# Altium schematic sheet MyCTRL_V2_Base_1.SchDoc
size A4; SheetNumber: 1; SheetTotal: 6
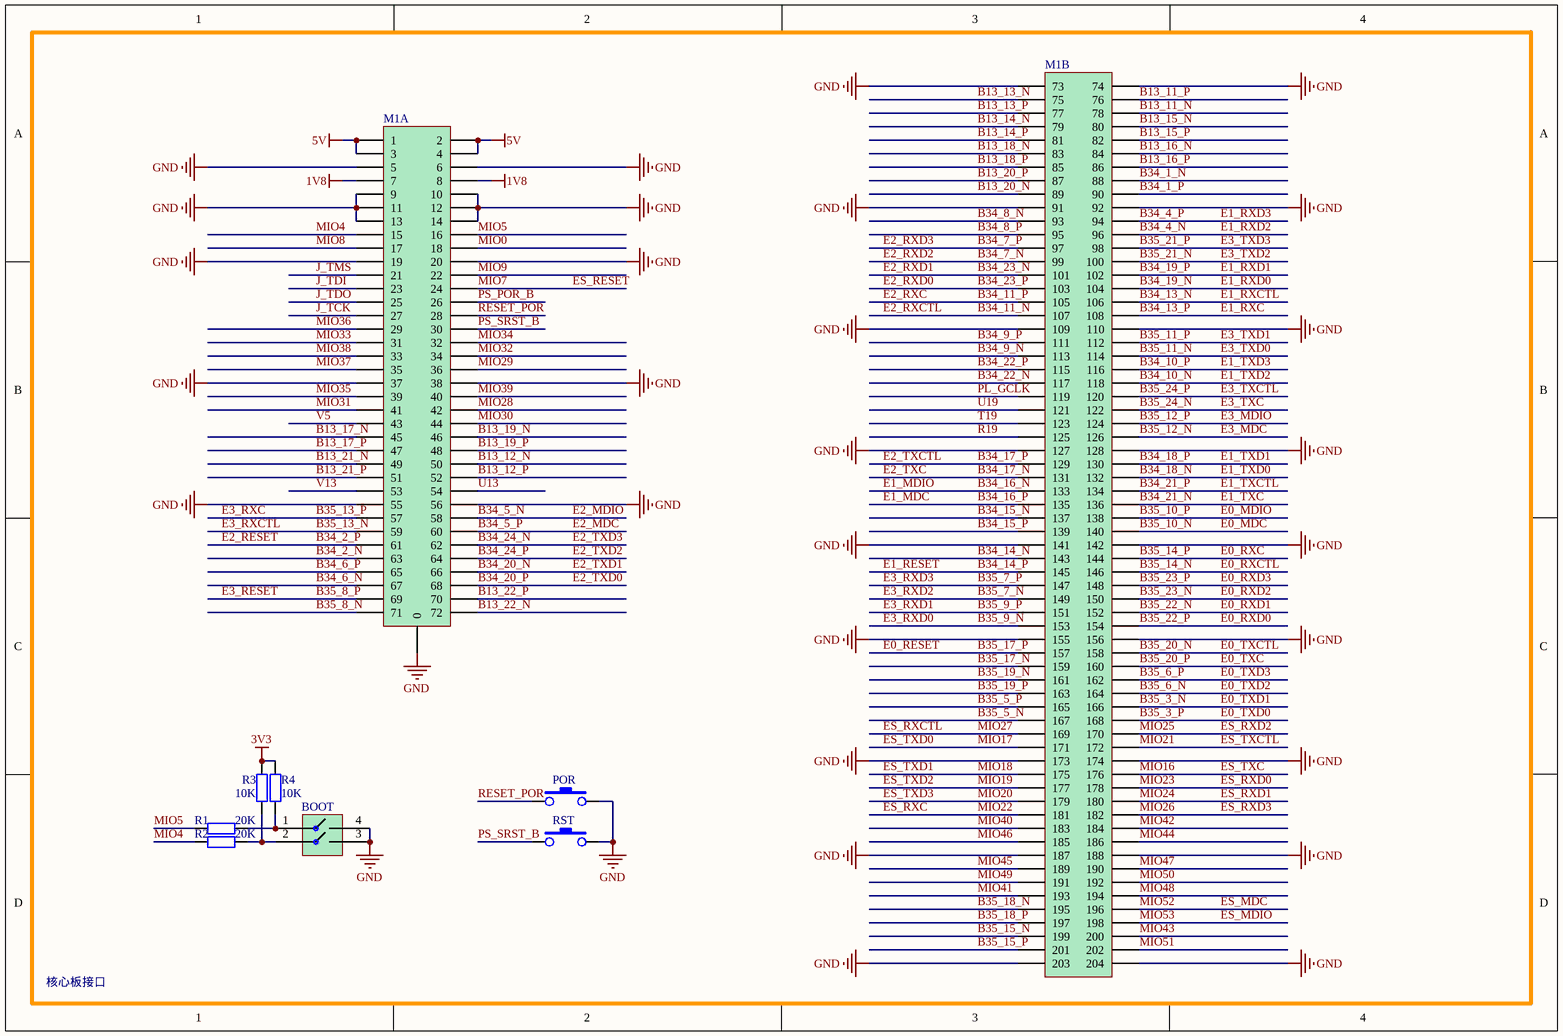
[diagram p0: MyCTRL_V2_Base_1.SchDoc]

## Parts
BOOT  DIP_SWITCH_2.54_2_SMD_S  [DIP_SWITCH_2.54_2_SMD_S]  (value not drawn)
M1  DDR3_204P_H8  [DDR3_204P_H8]  (value not drawn)  (parts A,B of 2)
POR  KEY  [KEY_DIP_6_L]  (value not drawn)
R1  20K  [R_0402]
R2  20K  [R_0402]
R3  10K  [R_0402]
R4  10K  [R_0402]
RST  KEY  [KEY_DIP_6_L]  (value not drawn)

## Nets
1V8: M1.7 M1.8
3V3: R3.2 R4.2
5V: M1.1 M1.2 M1.3 M1.4
GND: BOOT.3 BOOT.4 M1.0 M1.5 M1.6 M1.9 M1.10 M1.11 M1.12 M1.13 M1.14 M1.19 M1.20 M1.37 M1.38 M1.55 M1.56 M1.73 M1.74 M1.91 M1.92 M1.109 M1.110 M1.127 M1.128 M1.141 M1.142 M1.155 M1.156 M1.173 M1.174 M1.187 M1.188 M1.203 M1.204 POR.1 RST.1
B13_11_N: M1.78
B13_11_P: M1.76
B13_12_N: M1.50
B13_12_P: M1.52
B13_13_N: M1.75
B13_13_P: M1.77
B13_14_N: M1.79
B13_14_P: M1.81
B13_15_N: M1.80
B13_15_P: M1.82
B13_16_N: M1.84
B13_16_P: M1.86
B13_17_N: M1.45
B13_17_P: M1.47
B13_18_N: M1.83
B13_18_P: M1.85
B13_19_N: M1.46
B13_19_P: M1.48
B13_20_N: M1.89
B13_20_P: M1.87
B13_21_N: M1.49
B13_21_P: M1.51
B13_22_N: M1.72
B13_22_P: M1.70
B34_1_N: M1.88
B34_1_P: M1.90
B34_2_N: M1.63
B34_2_P: M1.61  [also labelled E2_RESET]
B34_4_N: M1.96  [also labelled E1_RXD2]
B34_4_P: M1.94  [also labelled E1_RXD3]
B34_5_N: M1.58  [also labelled E2_MDIO]
B34_5_P: M1.60  [also labelled E2_MDC]
B34_6_N: M1.67
B34_6_P: M1.65
B34_7_N: M1.99  [also labelled E2_RXD2]
B34_7_P: M1.97  [also labelled E2_RXD3]
B34_8_N: M1.93
B34_8_P: M1.95
B34_9_N: M1.113
B34_9_P: M1.111
B34_10_N: M1.118  [also labelled E1_TXD2]
B34_10_P: M1.116  [also labelled E1_TXD3]
B34_11_N: M1.107  [also labelled E2_RXCTL]
B34_11_P: M1.105  [also labelled E2_RXC]
B34_13_N: M1.106  [also labelled E1_RXCTL]
B34_13_P: M1.108  [also labelled E1_RXC]
B34_14_N: M1.143
B34_14_P: M1.145  [also labelled E1_RESET]
B34_15_N: M1.137
B34_15_P: M1.139
B34_16_N: M1.133  [also labelled E1_MDIO]
B34_16_P: M1.135  [also labelled E1_MDC]
B34_17_N: M1.131  [also labelled E2_TXC]
B34_17_P: M1.129  [also labelled E2_TXCTL]
B34_18_N: M1.132  [also labelled E1_TXD0]
B34_18_P: M1.130  [also labelled E1_TXD1]
B34_19_N: M1.104  [also labelled E1_RXD0]
B34_19_P: M1.102  [also labelled E1_RXD1]
B34_20_N: M1.66  [also labelled E2_TXD1]
B34_20_P: M1.68  [also labelled E2_TXD0]
B34_21_N: M1.136  [also labelled E1_TXC]
B34_21_P: M1.134  [also labelled E1_TXCTL]
B34_22_N: M1.117
B34_22_P: M1.115
B34_23_N: M1.101  [also labelled E2_RXD1]
B34_23_P: M1.103  [also labelled E2_RXD0]
B34_24_N: M1.62  [also labelled E2_TXD3]
B34_24_P: M1.64  [also labelled E2_TXD2]
B35_3_N: M1.166  [also labelled E0_TXD1]
B35_3_P: M1.168  [also labelled E0_TXD0]
B35_5_N: M1.167
B35_5_P: M1.165
B35_6_N: M1.164  [also labelled E0_TXD2]
B35_6_P: M1.162  [also labelled E0_TXD3]
B35_7_N: M1.149  [also labelled E3_RXD2]
B35_7_P: M1.147  [also labelled E3_RXD3]
B35_8_N: M1.71
B35_8_P: M1.69  [also labelled E3_RESET]
B35_9_N: M1.153  [also labelled E3_RXD0]
B35_9_P: M1.151  [also labelled E3_RXD1]
B35_10_N: M1.140  [also labelled E0_MDC]
B35_10_P: M1.138  [also labelled E0_MDIO]
B35_11_N: M1.114  [also labelled E3_TXD0]
B35_11_P: M1.112  [also labelled E3_TXD1]
B35_12_N: M1.126  [also labelled E3_MDC]
B35_12_P: M1.124  [also labelled E3_MDIO]
B35_13_N: M1.59  [also labelled E3_RXCTL]
B35_13_P: M1.57  [also labelled E3_RXC]
B35_14_N: M1.146  [also labelled E0_RXCTL]
B35_14_P: M1.144  [also labelled E0_RXC]
B35_15_N: M1.199
B35_15_P: M1.201
B35_17_N: M1.159
B35_17_P: M1.157  [also labelled E0_RESET]
B35_18_N: M1.195
B35_18_P: M1.197
B35_19_N: M1.161
B35_19_P: M1.163
B35_20_N: M1.158  [also labelled E0_TXCTL]
B35_20_P: M1.160  [also labelled E0_TXC]
B35_21_N: M1.100  [also labelled E3_TXD2]
B35_21_P: M1.98  [also labelled E3_TXD3]
B35_22_N: M1.152  [also labelled E0_RXD1]
B35_22_P: M1.154  [also labelled E0_RXD0]
B35_23_N: M1.150  [also labelled E0_RXD2]
B35_23_P: M1.148  [also labelled E0_RXD3]
B35_24_N: M1.122  [also labelled E3_TXC]
B35_24_P: M1.120  [also labelled E3_TXCTL]
ES_MDC: M1.196  [also labelled MIO52]
ES_MDIO: M1.198  [also labelled MIO53]
ES_RESET: M1.24  [also labelled MIO7]
ES_RXC: M1.181  [also labelled MIO22]
ES_RXCTL: M1.169  [also labelled MIO27]
ES_RXD0: M1.178  [also labelled MIO23]
ES_RXD1: M1.180  [also labelled MIO24]
ES_RXD2: M1.170  [also labelled MIO25]
ES_RXD3: M1.182  [also labelled MIO26]
ES_TXC: M1.176  [also labelled MIO16]
ES_TXCTL: M1.172  [also labelled MIO21]
ES_TXD0: M1.171  [also labelled MIO17]
ES_TXD1: M1.175  [also labelled MIO18]
ES_TXD2: M1.177  [also labelled MIO19]
ES_TXD3: M1.179  [also labelled MIO20]
J_TCK: M1.27
J_TDI: M1.23
J_TDO: M1.25
J_TMS: M1.21
MIO0: M1.18
MIO4: M1.15 R2.2
MIO5: M1.16 R1.2
MIO8: M1.17
MIO9: M1.22
MIO28: M1.42
MIO29: M1.36
MIO30: M1.44
MIO31: M1.41
MIO32: M1.34
MIO33: M1.31
MIO34: M1.32
MIO35: M1.39
MIO36: M1.29
MIO37: M1.35
MIO38: M1.33
MIO39: M1.40
MIO40: M1.183
MIO41: M1.193
MIO42: M1.184
MIO43: M1.200
MIO44: M1.186
MIO45: M1.189
MIO46: M1.185
MIO47: M1.190
MIO48: M1.194
MIO49: M1.191
MIO50: M1.192
MIO51: M1.202
PL_GCLK: M1.119
PS_POR_B: M1.26
PS_SRST_B: M1.30 RST.2
R19: M1.125
RESET_POR: M1.28 POR.2
T19: M1.123
U13: M1.54
U19: M1.121
V5: M1.43
V13: M1.53
NetBOOT_1: BOOT.1 R1.1 R4.1
NetBOOT_2: BOOT.2 R2.1 R3.1

## Notes on the sheet
- 核心板接口

## Library data of the parts
BOOT = DIP_SWITCH_2.54_2_SMD_S: 双路贴片立式拨码开关
POR RST = KEY_DIP_6_L: 直插卧式按键 6mm
R1-R4 = RES_0402: 电阻 0402